# EAGLE design Sensor-empty-long (EAGLE 6.5.0)
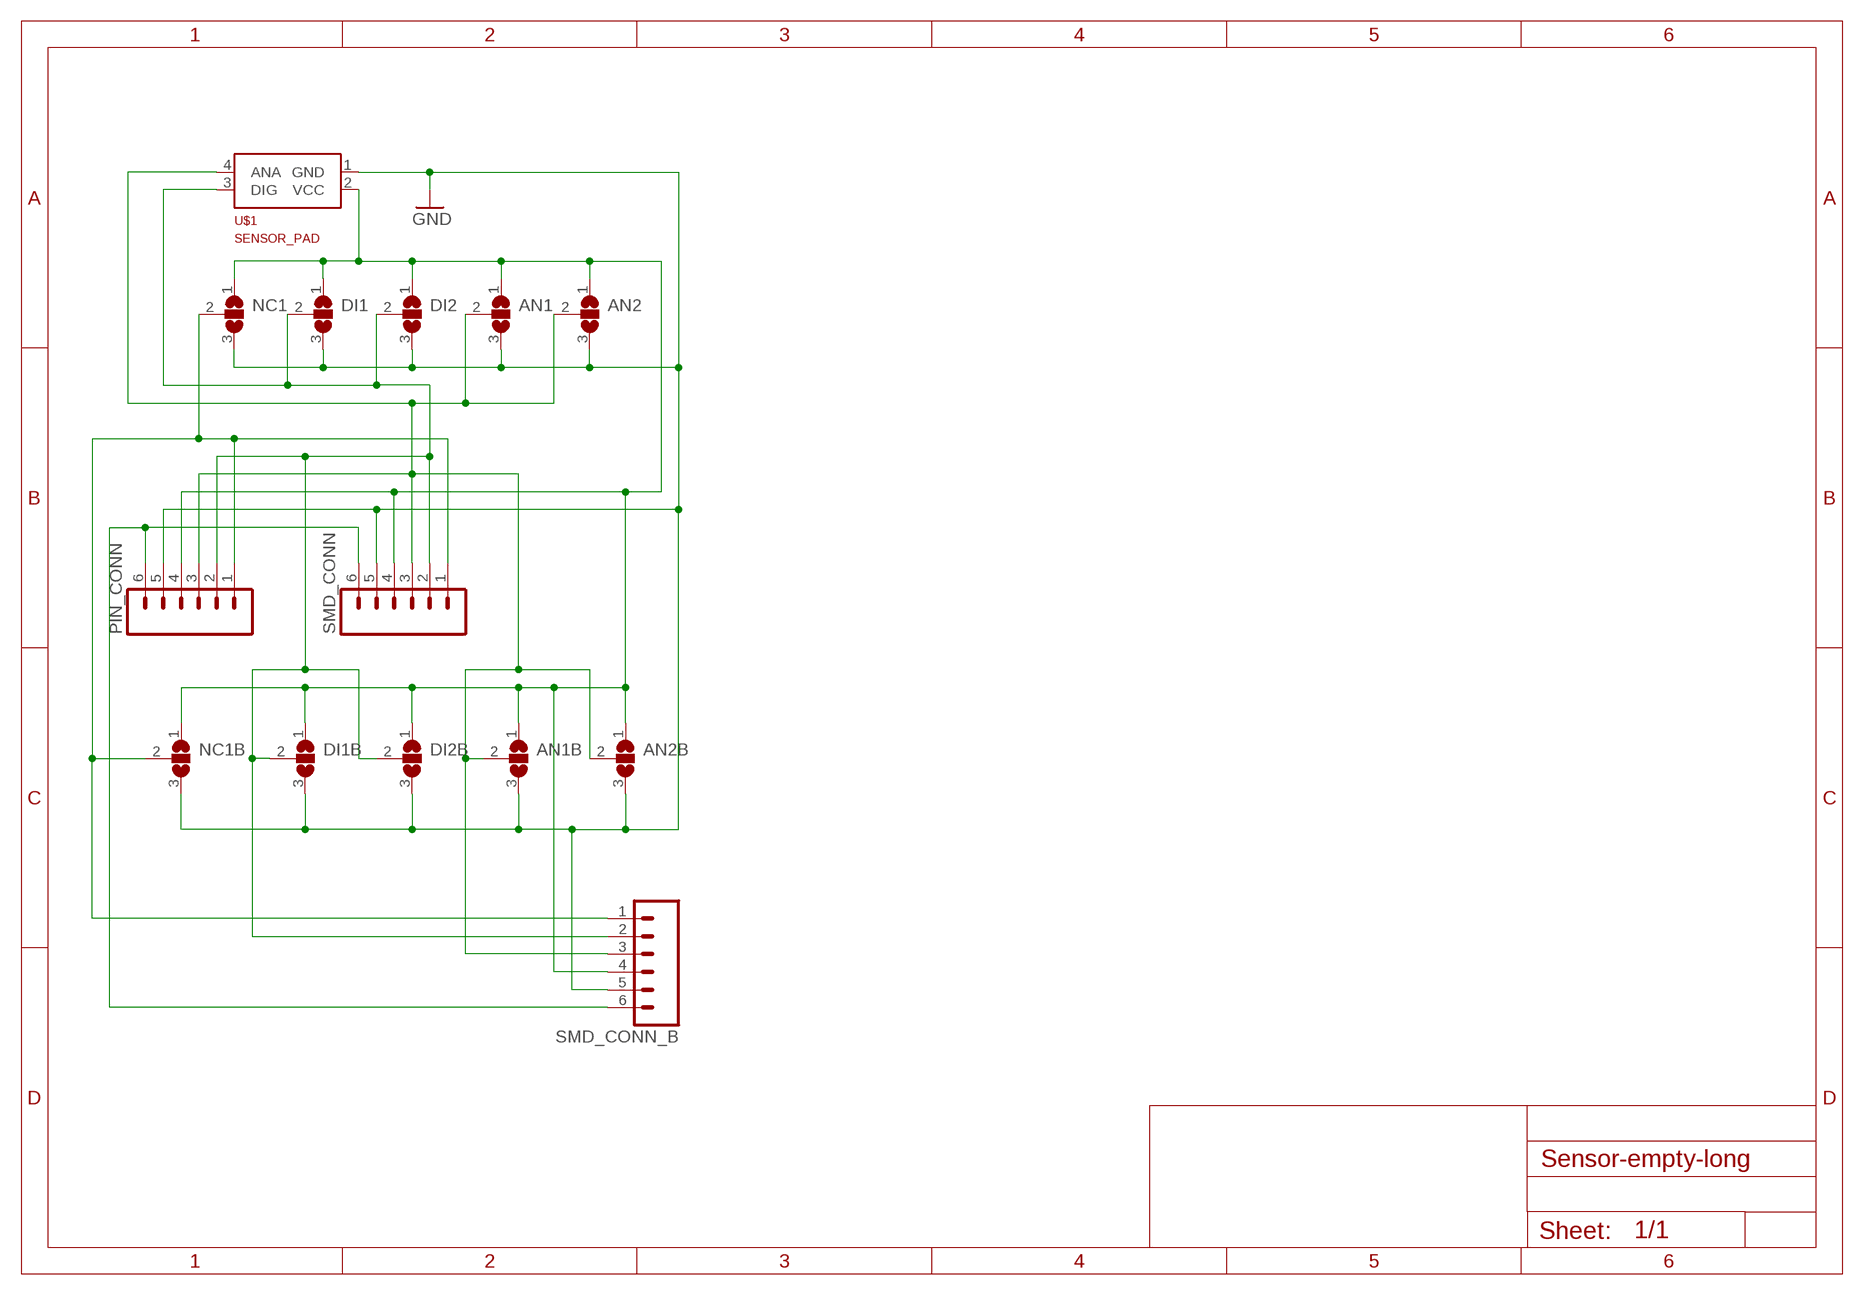
[diagram p0: schematic, sheet 1]

## Parts
AN1  SJ2W  [SJ_2]
AN1B  SJ2W  [SJ_2]
AN2  SJ2W  [SJ_2]
AN2B  SJ2W  [SJ_2]
DI1  SJ2W  [SJ_2]
DI1B  SJ2W  [SJ_2]
DI2  SJ2W  [SJ_2]
DI2B  SJ2W  [SJ_2]
NC1  SJ2W  [SJ_2]
NC1B  SJ2W  [SJ_2]
PIN_CONN  M06SILK_FEMALE_PTH  [1X06]
SMD_CONN  M06SMD-STRAIGHT-COMBO-FEMALE  [1X06_SMD_STRAIGHT_COMBO]
SMD_CONN_B  M06SMD-STRAIGHT-COMBO-FEMALE  [1X06_SMD_STRAIGHT_COMBO]
U$1  SENSOR_PAD  [SENSOR_PAD]

## Nets
GND: AN1.3 AN1B.3 AN2.3 AN2B.3 DI1.3 DI1B.3 DI2.3 DI2B.3 NC1.3 NC1B.3 PIN_CONN.5 SMD_CONN.5 SMD_CONN_B.5 U$1.1(GND)
N$2: AN1.2 AN1B.2 AN2.2 AN2B.2 PIN_CONN.3 SMD_CONN.3 SMD_CONN_B.3 U$1.4(ANA)
N$4: NC1.2 NC1B.2 PIN_CONN.1 SMD_CONN.1 SMD_CONN_B.1
N$7: AN1.1 AN1B.1 AN2.1 AN2B.1 DI1.1 DI1B.1 DI2.1 DI2B.1 NC1.1 NC1B.1 PIN_CONN.4 SMD_CONN.4 SMD_CONN_B.4 U$1.2(VCC)
N$8: PIN_CONN.6 SMD_CONN.6 SMD_CONN_B.6
N$10: DI1.2 DI1B.2 DI2.2 DI2B.2 PIN_CONN.2 SMD_CONN.2 SMD_CONN_B.2 U$1.3(DIG)

## Library data of the parts
AN1 AN1B AN2 AN2B DI1 DI1B DI2 DI2B NC1 NC1B = jumper:SJ2W: SMD solder JUMPER; OC_FARNELL: unknown
PIN_CONN = SparkFun-Connectors:M06: Header 6 Standard 6-pin 0.1" header. Use with straight break away headers (SKU : PRT-00116), right angle break away headers (PRT-00553), swiss pins (PRT-00743), machine pins (PRT-00117), and female headers (PRT-00115). Molex polarized connector foot print use with SKU : PRT-08094 with associated crimp pins and housings. NOTES ON THE VARIANTS LOCK and LOCK_LONGPADS... This footprint was designed to help hold the alignment of a through-hole component (i.e. 6-pin header) while soldering it into place. You may notice that each hole has been shifted either up or down by 0.005 of an inch from it's more standard position (which is a perfectly straight line). This slight alteration caused the pins (the squares in the middle) to touch the edges of the holes. Because they are alternating, it causes a "brace" to hold the component in place. 0.005 has proven to be the perfect amount of "off-center" position when using our standard breakaway headers. Although looks a little odd when you look at the bare footprint, once you have a header in there, the alteration is very hard to notice. Also,if you push a header all the way into place, it is covered up entirely on the bottom side. This idea of altering the position of holes to aid alignment will be further integrated into the Sparkfun Library for other footprints. It can help hold any component with 3 or more connection pins.; OC_FARNELL: unknown; PROD_ID: CONN-08437
SMD_CONN SMD_CONN_B = SparkFun-Connectors:M06: Header 6 Standard 6-pin 0.1" header. Use with straight break away headers (SKU : PRT-00116), right angle break away headers (PRT-00553), swiss pins (PRT-00743), machine pins (PRT-00117), and female headers (PRT-00115). Molex polarized connector foot print use with SKU : PRT-08094 with associated crimp pins and housings. NOTES ON THE VARIANTS LOCK and LOCK_LONGPADS... This footprint was designed to help hold the alignment of a through-hole component (i.e. 6-pin header) while soldering it into place. You may notice that each hole has been shifted either up or down by 0.005 of an inch from it's more standard position (which is a perfectly straight line). This slight alteration caused the pins (the squares in the middle) to touch the edges of the holes. Because they are alternating, it causes a "brace" to hold the component in place. 0.005 has proven to be the perfect amount of "off-center" position when using our standard breakaway headers. Although looks a little odd when you look at the bare footprint, once you have a header in there, the alteration is very hard to notice. Also,if you push a header all the way into place, it is covered up entirely on the bottom side. This idea of altering the position of holes to aid alignment will be further integrated into the Sparkfun Library for other footprints. It can help hold any component with 3 or more connection pins.; MF: GLOBAL CONNECTOR TECHNOLOGY; MPN: BG306-06-A-1-0400-L-B; OC_FARNELL: 2443091; PROD_ID: CONN-10203
U$1 = sduino:SENSOR_PAD; OC_FARNELL: unknown

## Board
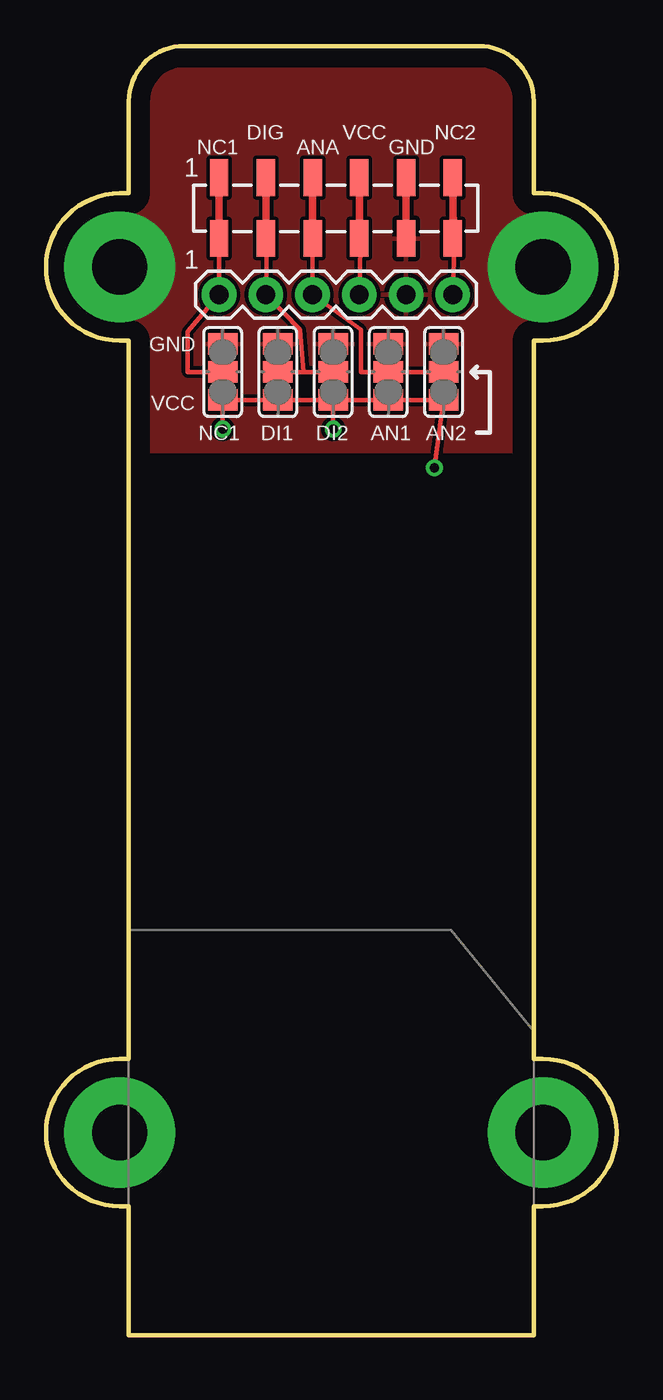
[diagram p1: board, top side]
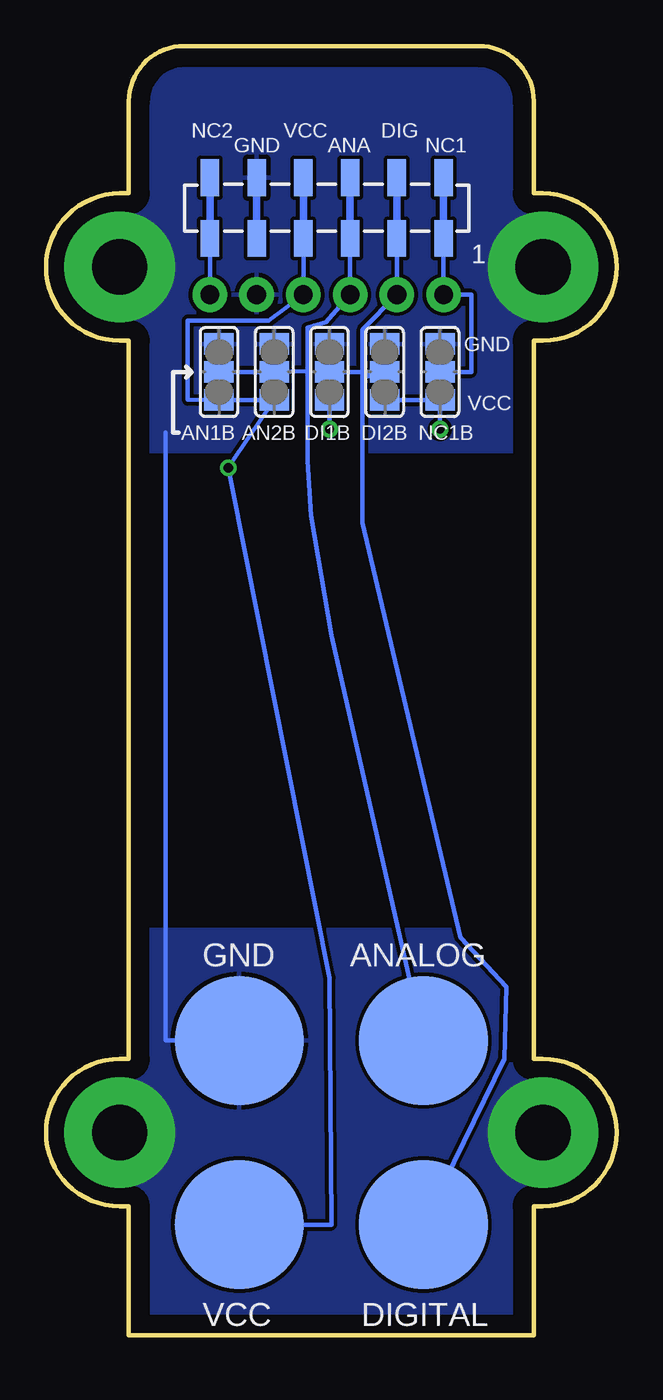
[diagram p2: board, bottom side, seen from below]

Size 31 x 70 mm. Coordinates in mm from the lower left corner, seen from the top.
Outline: 26.5,0 4.5,0 4.5,7 4,7 arc-180 4,15 4.5,15 4.5,54 4,54 arc-180 4,62 4.5,62 4.5,67 arc-90 7.5,70 23.5,70 arc-90 26.5,67 26.5,62 27,62 arc-180 27,54 26.5,54 26.5,15 27,15 arc-180 27,7 26.5,7 26.5,0
Copper layers (1*16): Top 0.035mm / dielectric 1.5mm / Bottom 0.035mm
Design rules "default *": minimum track width 10mil, minimum drill 24mil, track to track 8mil, track to pad 8mil, pad to pad 8mil, via to via 8mil, smd to smd 8mil, copper to edge 40mil, drill to drill 8mil, minimum pad ring 10mil, minimum via ring 8mil, stop-mask expansion 4mil, vias tented up to drill 50mil, thermal gap 10mil

### Footprints (pad centres in the part's own frame; a part is rotated, then mirrored left to right if it is on the bottom)
SJ_2 = smd 1.168 x 1.6: 1 -1.524,0; 2 0,0; 3 1.524,0
1X06 = drill 1.016 pad 1.88: 1 0,0; 2 2.54,0; 3 5.08,0; 4 7.62,0; 5 10.16,0; 6 12.7,0
1X06_SMD_STRAIGHT_COMBO = smd 1 x 2: 1 0,-1.65; 1-2 0,1.65; 2 2.54,1.65; 2-2 2.54,-1.65; 3 5.08,-1.65; 3-2 5.08,1.65; 4 7.62,1.65; 4-2 7.62,-1.65; 5 10.16,-1.65; 5-2 10.16,1.65; 6 12.7,1.65; 6-2 12.7,-1.65
SENSOR_PAD = smd 7 x 7 bottom: 1 16,16; 2 16,6; 3 6,6; 4 6,16

### Placement (x,y rotation side)
AN1  18.6,52.3 90 top
AN1B  21.6,52.3 90 bottom
AN2  21.6,52.3 90 top
AN2B  18.6,52.3 90 bottom
DI1  12.6,52.3 90 top
DI1B  15.6,52.3 90 bottom
DI2  15.6,52.3 90 top
DI2B  12.6,52.3 90 bottom
NC1  9.6,52.3 90 top
NC1B  9.6,52.3 90 bottom
PIN_CONN  9.4,56.5 0 top
SMD_CONN  9.4,61.2 0 top
SMD_CONN_B  9.4,61.2 180 bottom
U$1  4.5,0 0 top

### Tracks (layer width: path | path; a pad name or v marks a point on that pad's centre or on a via)
GND  (via drill 3 pad 6)
  Bottom 0.254: U$1.1 24.5,16 24.5,49
  other vias: 4,58 27,58 4,11 27,11
  pour Top: -1.5,72 -1.5,48 33.5,48 33.5,72
  pour Bottom: -1.5,22 -1.5,-2 33.5,-2 33.5,22
  pour Bottom: -1.5,72 -1.5,48 33.5,48 33.5,72
N$2
  Top 0.254: SMD_CONN.3 PIN_CONN.3 17.1,54.6 17.1,52.3 AN2B.2 AN1B.2
  Bottom 0.254: U$1.4 15.5,38 16.6,44.5 16.8,47.5 16.8,52.34 | 16.8,52.34 16.8,54.7 15.8,55 PIN_CONN.3 SMD_CONN_B.3 | AN1B.2 AN2B.2 16.8,52.34
N$4
  Top 0.254: SMD_CONN.1 PIN_CONN.1 7.7,54.5 7.7,52.3 NC1B.2
  Bottom 0.254: NC1B.2 7.9,52.3 7.9,56.5 PIN_CONN.1 SMD_CONN_B.1
N$7  (via drill 0.5)
  Top 0.254: SMD_CONN.4 17.1,60.5 PIN_CONN.4 | DI1B.1 DI2B.1 NC1B.1 v9.6,49.2 | DI1B.1 AN2B.1 AN1B.1 v21.1,47.1 | v15.6,49.2 DI1B.1
  Bottom 0.254: U$1.2 15.5,6 15.6,19.4 20.96,46.33 v21.1,47.1 AN2B.1 AN1B.1 23.3,50.8 23.3,55.1 18.9,55.1 PIN_CONN.4 SMD_CONN_B.4 | DI2B.1 NC1B.1 v9.6,49.2 | DI1B.1 v15.6,49.2
N$8
  Top 0.254: SMD_CONN.6 22.2,60.4 PIN_CONN.6
  Bottom 0.254: SMD_CONN_B.6 PIN_CONN.6
N$10
  Top 0.254: SMD_CONN.2 12,60.5 PIN_CONN.2 13.8,54.6 14,52.3 | DI1B.2 14,52.3 | 14,52.3 DI2B.2
  Bottom 0.254: U$1.3 6.1,15 6,18.9 8.5,21.6 13.8,44.1 13.8,52 | 13.8,52 13.8,54.6 PIN_CONN.2 SMD_CONN_B.2 | DI1B.2 DI2B.2 13.8,52

### Text on the board
tNames: DIG | VCC | NC2 | NC1 | ANA | GND | 1 | 1 | GND | VCC
bNames: DIG | VCC | NC2 | NC1 | ANA | GND | 1 | GND | VCC